# Altium schematic sheet Inchworm_v0.SchDoc
size A
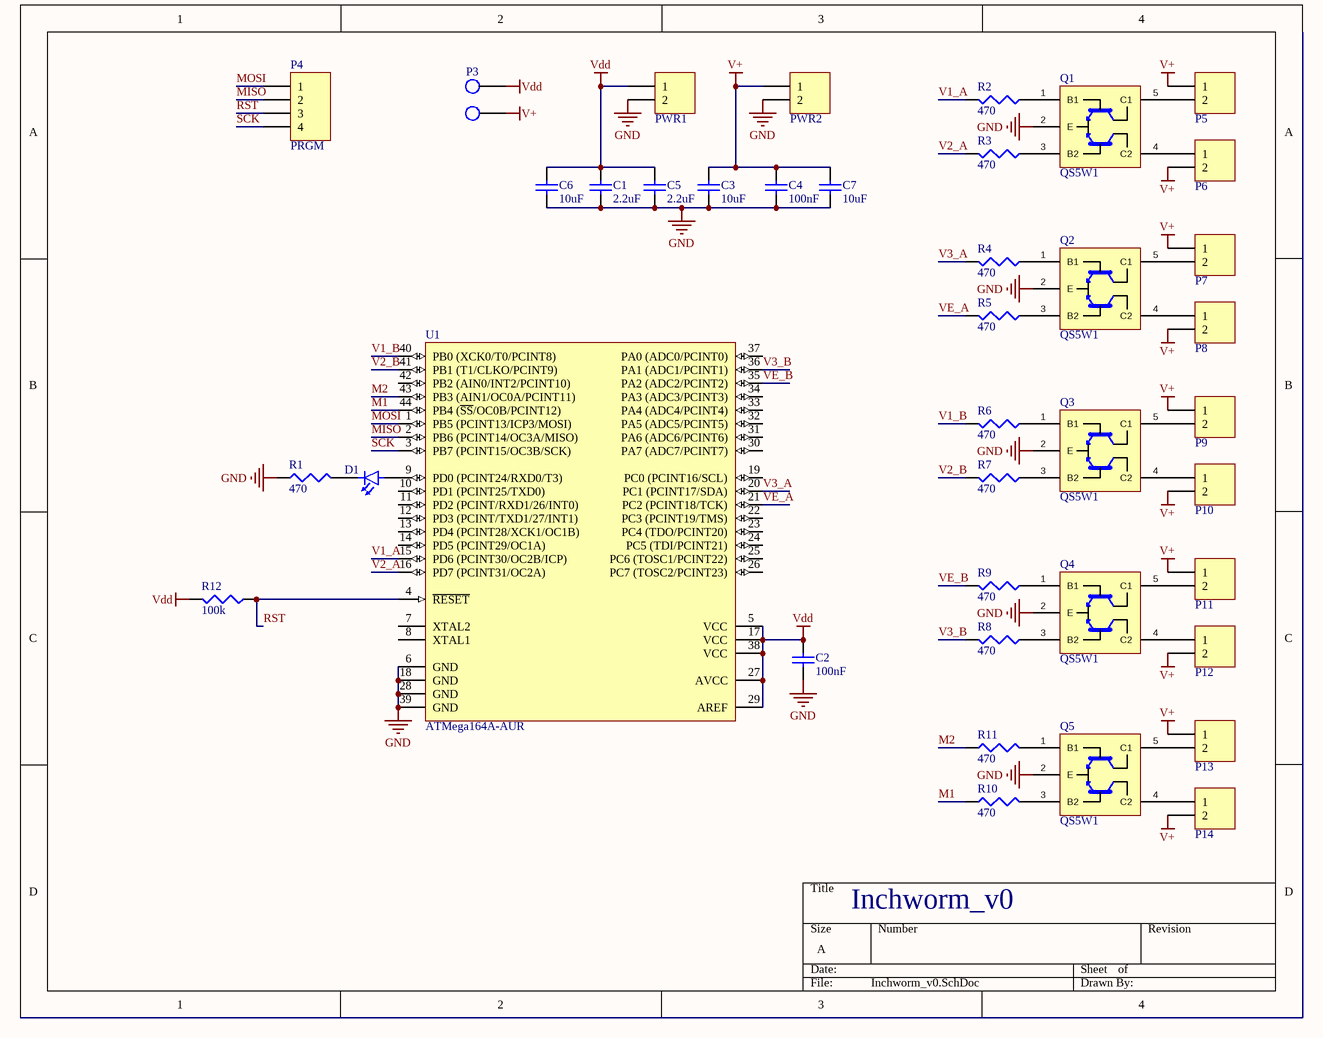
[diagram p0: Inchworm_v0.SchDoc]

## Parts
C1  value 2.2uF  [SMD0603_cap]  (hidden comment: Cap)
C2  value 100nF  [SMD0603_cap]  (hidden comment: Cap)
C3  value 10uF  [SMD0603_cap]  (hidden comment: Cap)
C4  value 100nF  [SMD0603_cap]  (hidden comment: Cap)
C5  value 2.2uF  [SMD0603_cap]  (hidden comment: Cap)
C6  value 10uF  [SMD0603_cap]  (hidden comment: Cap)
C7  value 10uF  [SMD0603_cap]  (hidden comment: Cap)
D1  LED  [SMD0603 POLARIZED]  (value not drawn)
P1  PWR1  [Header 2x1]
P2  PWR2  [Header 2x1]
P3  Via 2x1  [Via 2x1]  (value not drawn)
P4  PRGM  [Header 4x1]
P5  Header  [Via 2x1_small]  (value not drawn)
P6  Header  [Via 2x1_small]  (value not drawn)
P7  Header  [Via 2x1_small]  (value not drawn)
P8  Header  [Via 2x1_small]  (value not drawn)
P9  Header  [Via 2x1_small]  (value not drawn)
P10  Header  [Via 2x1_small]  (value not drawn)
P11  Header  [Via 2x1_small]  (value not drawn)
P12  Header  [Via 2x1_small]  (value not drawn)
P13  Header  [Via 2x1_small]  (value not drawn)
P14  Header  [Via 2x1_small]  (value not drawn)
Q1  QS5W1  [TSMT5]
Q2  QS5W1  [TSMT5]
Q3  QS5W1  [TSMT5]
Q4  QS5W1  [TSMT5]
Q5  QS5W1  [TSMT5]
R1  value 470  [SMD0603_res]  (hidden comment: Res)
R2  value 470  [SMD0603_res]  (hidden comment: Res)
R3  value 470  [SMD0603_res]  (hidden comment: Res)
R4  value 470  [SMD0603_res]  (hidden comment: Res)
R5  value 470  [SMD0603_res]  (hidden comment: Res)
R6  value 470  [SMD0603_res]  (hidden comment: Res)
R7  value 470  [SMD0603_res]  (hidden comment: Res)
R8  value 470  [SMD0603_res]  (hidden comment: Res)
R9  value 470  [SMD0603_res]  (hidden comment: Res)
R10  value 470  [SMD0603_res]  (hidden comment: Res)
R11  value 470  [SMD0603_res]  (hidden comment: Res)
R12  value 100k  [SMD0603_res]  (hidden comment: Res)
U1  ATMega164A-AUR  [TQFP44]

## Nets
GND: C1.1 C2.1 C3.1 C4.1 C5.1 C6.1 C7.1 P1.2 P2.2 Q1.2(E) Q2.2(E) Q3.2(E) Q4.2(E) Q5.2(E) R1.1 U1.6(GND) U1.18(GND) U1.28(GND) U1.39(GND)
V+: C3.2 C4.2 C7.2 P2.1 P3.2 P5.1 P6.2 P7.1 P8.2 P9.1 P10.2 P11.1 P12.2 P13.1 P14.2
Vdd: C1.2 C2.2 C5.2 C6.2 P1.1 P3.1 R12.2 U1.5(VCC) U1.17(VCC) U1.27(AVCC) U1.29(AREF) U1.38(VCC)
M1: R10.1 U1.44(PB4_(~{SS}/OC0B/PCINT12))
M2: R11.1 U1.43(PB3_(AIN1/OC0A/PCINT11))
MISO: P4.2 U1.2(PB6_(PCINT14/OC3A/MISO))
MOSI: P4.1 U1.1(PB5_(PCINT13/ICP3/MOSI))
RST: P4.3 R12.1 U1.4(~{RESET})
SCK: P4.4 U1.3(PB7_(PCINT15/OC3B/SCK))
V1_A: R2.2 U1.15(PD6_(PCINT30/OC2B/ICP))
V1_B: R6.2 U1.40(PB0_(XCK0/T0/PCINT8))
V2_A: R3.2 U1.16(PD7_(PCINT31/OC2A))
V2_B: R7.2 U1.41(PB1_(T1/CLKO/PCINT9))
V3_A: R4.2 U1.20(PC1_(PCINT17/SDA))
V3_B: R8.2 U1.36(PA1_(ADC1/PCINT1))
VE_A: R5.2 U1.21(PC2_(PCINT18/TCK))
VE_B: R9.2 U1.35(PA2_(ADC2/PCINT2))
NetD1_1: D1.1(Anode_(+)) U1.9(PD0_(PCINT24/RXD0/T3))
NetD1_2: D1.2(Cathode_(-)) R1.2
NetP5_2: P5.2 Q1.5(C1)
NetP6_1: P6.1 Q1.4(C2)
NetP7_2: P7.2 Q2.5(C1)
NetP8_1: P8.1 Q2.4(C2)
NetP9_2: P9.2 Q3.5(C1)
NetP10_1: P10.1 Q3.4(C2)
NetP11_2: P11.2 Q4.5(C1)
NetP12_1: P12.1 Q4.4(C2)
NetP13_2: P13.2 Q5.5(C1)
NetP14_1: P14.1 Q5.4(C2)
NetQ1_1: Q1.1(B1) R2.1
NetQ1_3: Q1.3(B2) R3.1
NetQ2_1: Q2.1(B1) R4.1
NetQ2_3: Q2.3(B2) R5.1
NetQ3_1: Q3.1(B1) R6.1
NetQ3_3: Q3.3(B2) R7.1
NetQ4_1: Q4.1(B1) R9.1
NetQ4_3: Q4.3(B2) R8.1
NetQ5_1: Q5.1(B1) R11.2
NetQ5_3: Q5.3(B2) R10.2

Not connected (* = marked no-connect by the designer): U1 7(XTAL2) 8(XTAL1) 10(PD1_(PCINT25/TXD0)) 11(PD2_(PCINT/RXD1/26/INT0)) 12(PD3_(PCINT/TXD1/27/INT1)) 13(PD4_(PCINT28/XCK1/OC1B)) 14(PD5_(PCINT29/OC1A)) 19(PC0_(PCINT16/SCL)) 22(PC3_(PCINT19/TMS)) 23(PC4_(TDO/PCINT20)) 24(PC5_(TDI/PCINT21)) 25(PC6_(TOSC1/PCINT22)) 26(PC7_(TOSC2/PCINT23)) 30(PA7_(ADC7/PCINT7)) 31(PA6_(ADC6/PCINT6)) 32(PA5_(ADC5/PCINT5)) 33(PA4_(ADC4/PCINT4)) 34(PA3_(ADC3/PCINT3)) 37(PA0_(ADC0/PCINT0)) 42(PB2_(AIN0/INT2/PCINT10))

## Notes on the sheet
- Inchworm_v0

## Library data of the parts
C1-C7 = Capacitor Ceramic: Ceramic Chip Capacitor
P1 P2 P5-P14 = Header 2x1: Header, 2-Pin
P4 = Header 4x1
Q1-Q5 = QS5W1: Two Medium-Power NPN BJTs with Common Emitter.  Rohm Semi.
R1-R12 = Resistor